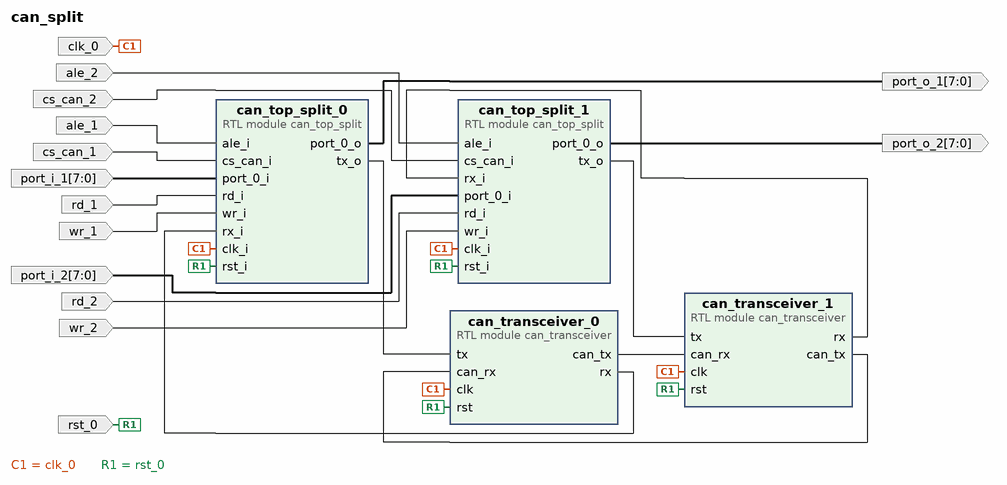
[diagram p0: block diagram of the top level]
# Vivado block design can_split, xc7a200tsbg484-1, Vivado 2023.2
create_bd_design can_split

create_bd_port -dir I -type clk clk_0
create_bd_port -dir I cs_can_1
create_bd_port -dir I ale_1
create_bd_port -dir I -from 7 -to 0 port_i_1
create_bd_port -dir I rd_1
create_bd_port -dir I wr_1
create_bd_port -dir O -from 7 -to 0 port_o_1
create_bd_port -dir I cs_can_2
create_bd_port -dir I ale_2
create_bd_port -dir I -from 7 -to 0 port_i_2
create_bd_port -dir I rd_2
create_bd_port -dir I wr_2
create_bd_port -dir O -from 7 -to 0 port_o_2
create_bd_port -dir I rst_0

create_bd_cell -type module -reference can_top_split can_top_split_0
create_bd_cell -type module -reference can_top_split can_top_split_1
create_bd_cell -type module -reference can_transceiver can_transceiver_0
create_bd_cell -type module -reference can_transceiver can_transceiver_1

# ---- connections ----

connect_bd_net -net ale_i_0_1 [get_bd_ports ale_1] [get_bd_pins can_top_split_0/ale_i]
connect_bd_net -net ale_i_1_1 [get_bd_ports ale_2] [get_bd_pins can_top_split_1/ale_i]
connect_bd_net [get_bd_pins can_top_split_0/port_0_o] [get_bd_ports port_o_1]
connect_bd_net [get_bd_pins can_top_split_0/tx_o] [get_bd_pins can_transceiver_0/tx]
connect_bd_net [get_bd_pins can_top_split_1/port_0_o] [get_bd_ports port_o_2]
connect_bd_net [get_bd_pins can_top_split_1/tx_o] [get_bd_pins can_transceiver_1/tx]
connect_bd_net [get_bd_pins can_transceiver_0/can_tx] [get_bd_pins can_transceiver_1/can_rx]
connect_bd_net [get_bd_pins can_transceiver_0/rx] [get_bd_pins can_top_split_0/rx_i]
connect_bd_net [get_bd_pins can_transceiver_1/can_tx] [get_bd_pins can_transceiver_0/can_rx]
connect_bd_net [get_bd_pins can_transceiver_1/rx] [get_bd_pins can_top_split_1/rx_i]
connect_bd_net -net clk_0_1 [get_bd_ports clk_0] \
  [get_bd_pins can_top_split_0/clk_i] [get_bd_pins can_top_split_1/clk_i] [get_bd_pins can_transceiver_0/clk] \
  [get_bd_pins can_transceiver_1/clk]
connect_bd_net -net cs_can_i_0_1 [get_bd_ports cs_can_1] [get_bd_pins can_top_split_0/cs_can_i]
connect_bd_net -net cs_can_i_1_1 [get_bd_ports cs_can_2] [get_bd_pins can_top_split_1/cs_can_i]
connect_bd_net -net port_0_i_0_1 [get_bd_ports port_i_1] [get_bd_pins can_top_split_0/port_0_i]
connect_bd_net -net port_0_i_1_1 [get_bd_ports port_i_2] [get_bd_pins can_top_split_1/port_0_i]
connect_bd_net -net rd_i_0_1 [get_bd_ports rd_1] [get_bd_pins can_top_split_0/rd_i]
connect_bd_net -net rd_i_1_1 [get_bd_ports rd_2] [get_bd_pins can_top_split_1/rd_i]
connect_bd_net -net rst_i_0_1 [get_bd_ports rst_0] \
  [get_bd_pins can_top_split_0/rst_i] [get_bd_pins can_top_split_1/rst_i] [get_bd_pins can_transceiver_0/rst] \
  [get_bd_pins can_transceiver_1/rst]
connect_bd_net -net wr_i_0_1 [get_bd_ports wr_1] [get_bd_pins can_top_split_0/wr_i]
connect_bd_net -net wr_i_1_1 [get_bd_ports wr_2] [get_bd_pins can_top_split_1/wr_i]

validate_bd_design
save_bd_design
